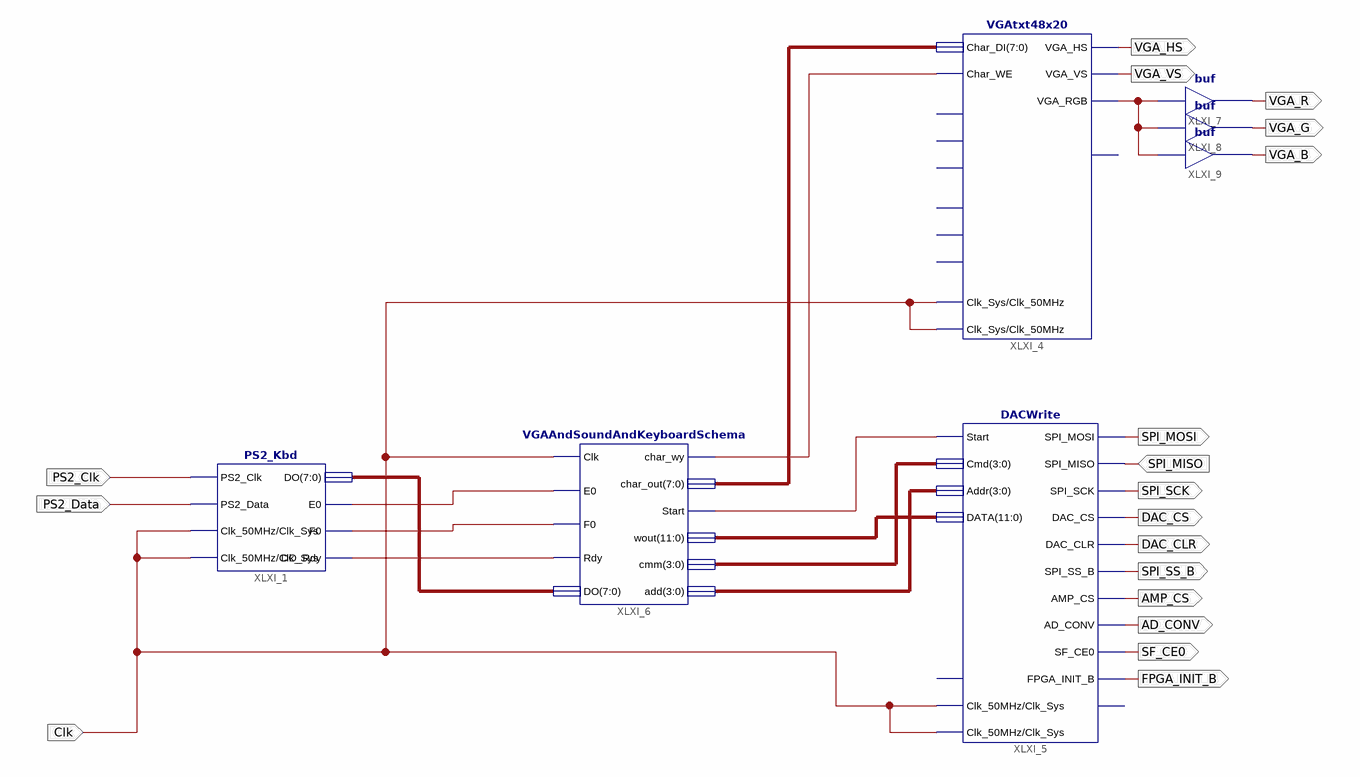
[diagram p0: schematic sheet 1]
// Xilinx ISE schematic FinalSchema.sch (spartan3e) as structural Verilog: 7 symbols, 18 ports
module FinalSchema (
  input  PS2_Clk,
  input  PS2_Data,
  input  Clk,
  input  SPI_MISO,
  output SPI_MOSI,
  output SPI_SCK,
  output DAC_CS,
  output DAC_CLR,
  output SPI_SS_B,
  output AMP_CS,
  output AD_CONV,
  output SF_CE0,
  output FPGA_INIT_B,
  output VGA_HS,
  output VGA_VS,
  output VGA_R,
  output VGA_G,
  output VGA_B
);

  wire XLXN_18, XLXN_19, XLXN_20, XLXN_22, XLXN_26, XLXN_32;
  wire [3:0] XLXN_24, XLXN_25;
  wire [7:0] XLXN_21, XLXN_27;
  wire [11:0] XLXN_23;

  PS2_Kbd XLXI_1 (
    .PS2_Clk(PS2_Clk), .PS2_Data(PS2_Data), .Clk_50MHz(Clk), .E0(XLXN_18), .F0(XLXN_19), .DO_Rdy(XLXN_20),
    .DO(XLXN_21), .Clk_Sys(Clk));
  VGAtxt48x20 XLXI_4 (
    .Char_DI(XLXN_27), .Clk_Sys(Clk), .Clk_50MHz(Clk), .VGA_HS(VGA_HS), .VGA_VS(VGA_VS), .VGA_RGB(XLXN_32),
    .Char_WE(XLXN_26));  // open: Home, NewLine, Goto00, CursorOn, ScrollEn, ScrollClear, Busy
  DACWrite XLXI_5 (
    .Start(XLXN_22), .SPI_MISO(SPI_MISO), .Cmd(XLXN_25), .Addr(XLXN_24), .DATA(XLXN_23), .DAC_CLR(DAC_CLR),
    .DAC_CS(DAC_CS), .SPI_MOSI(SPI_MOSI), .SPI_SCK(SPI_SCK), .SPI_SS_B(SPI_SS_B), .AMP_CS(AMP_CS),
    .AD_CONV(AD_CONV), .SF_CE0(SF_CE0), .FPGA_INIT_B(FPGA_INIT_B), .Clk_50MHz(Clk), .Clk_Sys(Clk));  // open: Reset, Busy
  VGAAndSoundAndKeyboardSchema XLXI_6 (
    .Clk(Clk), .E0(XLXN_18), .F0(XLXN_19), .Rdy(XLXN_20), .DO(XLXN_21), .char_wy(XLXN_26),
    .char_out(XLXN_27), .Start(XLXN_22), .wout(XLXN_23), .cmm(XLXN_25), .add(XLXN_24));
  buf XLXI_7 (VGA_R, XLXN_32);
  buf XLXI_8 (VGA_G, XLXN_32);
  buf XLXI_9 (VGA_B, XLXN_32);
endmodule
